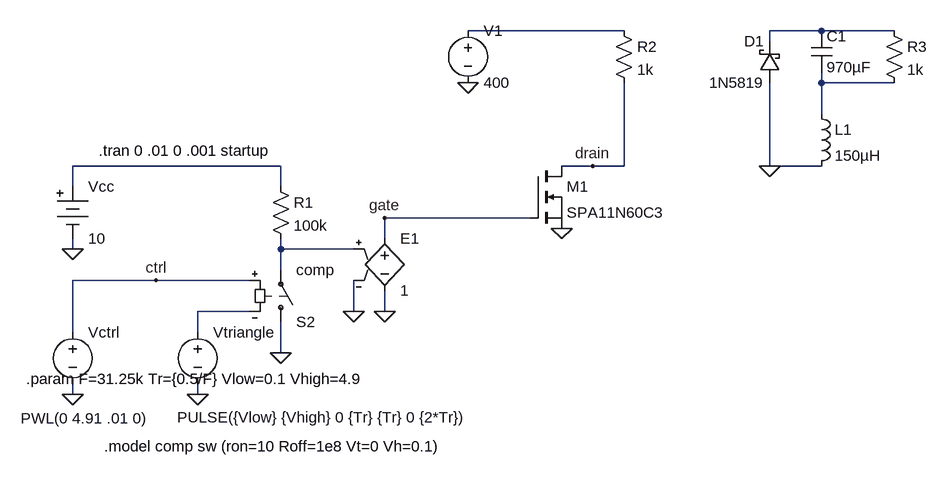
[diagram p0: schematic ripplecompensator4-regularfet.asc]
ripplecompensator4-regularfet.asc, the LTspice schematic file:
Version 4
SHEET 1 1420 680
WIRE 688 -160 448 -160
WIRE 992 -160 912 -160
WIRE 1104 -160 992 -160
WIRE 912 -144 912 -160
WIRE 992 -80 992 -96
WIRE 1104 -80 992 -80
WIRE 992 -32 992 -80
WIRE 160 48 -160 48
WIRE 640 48 592 48
WIRE 688 48 688 -80
WIRE 688 48 640 48
WIRE 912 48 912 -80
WIRE 992 48 912 48
WIRE -160 80 -160 48
WIRE 160 80 160 48
WIRE 544 128 320 128
WIRE 320 160 320 128
WIRE -160 176 -160 160
WIRE 160 176 160 160
WIRE 272 176 160 176
WIRE 160 208 160 176
WIRE -32 224 -160 224
WIRE 112 224 -32 224
WIRE 112 272 32 272
WIRE 272 272 272 224
WIRE 320 272 320 240
WIRE -160 304 -160 224
WIRE 32 304 32 272
WIRE 160 336 160 288
WIRE -160 400 -160 384
WIRE 32 400 32 384
FLAG 160 336 0
FLAG 32 400 0
FLAG -160 400 0
FLAG -160 176 0
FLAG 320 272 0
FLAG 272 272 0
FLAG 320 128 gate
FLAG -32 224 ctrl
FLAG 640 48 drain
FLAG 448 -80 0
FLAG 592 144 0
FLAG 912 48 0
SYMBOL sw 160 304 M180
SYMATTR InstName S2
SYMATTR Value comp
SYMBOL res 144 64 R0
SYMATTR InstName R1
SYMATTR Value 100k
SYMBOL voltage 32 288 R0
WINDOW 3 -31 147 Left 2
WINDOW 123 0 0 Left 2
WINDOW 39 0 0 Left 2
SYMATTR Value PULSE({Vlow} {Vhigh} 0 {Tr} {Tr} 0 {2*Tr})
SYMATTR InstName Vtriangle
SYMBOL voltage -160 288 R0
WINDOW 3 -80 149 Left 2
WINDOW 123 0 0 Left 2
WINDOW 39 0 0 Left 2
SYMATTR Value PWL(0 4.91 .01 0)
SYMATTR InstName Vctrl
SYMBOL battery -160 64 R0
WINDOW 123 0 0 Left 2
WINDOW 39 0 0 Left 2
SYMATTR InstName Vcc
SYMATTR Value 10
SYMBOL e 320 144 R0
SYMATTR InstName E1
SYMATTR Value 1
SYMBOL ind 976 -48 R0
SYMATTR InstName L1
SYMATTR Value 150µH
SYMBOL schottky 928 -80 R180
WINDOW 0 24 64 Left 2
WINDOW 3 24 0 Left 2
SYMATTR InstName D1
SYMATTR Value 1N5819
SYMATTR Description Diode
SYMATTR Type diode
SYMBOL cap 976 -160 R0
SYMATTR InstName C1
SYMATTR Value 970µF
SYMBOL voltage 448 -176 R0
WINDOW 123 0 0 Left 2
WINDOW 39 0 0 Left 2
SYMATTR InstName V1
SYMATTR Value 400
SYMBOL res 1088 -176 R0
SYMATTR InstName R3
SYMATTR Value 1k
SYMBOL nmos 544 48 R0
SYMATTR InstName M1
SYMATTR Value SPA11N60C3
SYMBOL res 672 -176 R0
SYMATTR InstName R2
SYMATTR Value 1k
TEXT -112 480 Left 2 !.model comp sw (ron=10 Roff=1e8 Vt=0 Vh=0.1)
TEXT -232 376 Left 2 !.param F=31.25k Tr={0.5/F} Vlow=0.1 Vhigh=4.9
TEXT -120 24 Left 2 !.tran 0 .01 0 .001 startup

The netlist it stands for:
* ripplecompensator4-regularfet.asc
S2 0 N005 ctrl N006 comp
R1 N004 N005 100k
Vtriangle N006 0 PULSE({Vlow} {Vhigh} 0 {Tr} {Tr} 0 {2*Tr})
Vctrl ctrl 0 PWL(0 4.91 .01 0)
Vcc N004 0 10
E1 gate 0 N005 0 1
L1 N003 0 150µH
D1 0 N002 1N5819
C1 N002 N003 970µF
V1 N001 0 400
R3 N002 N003 1k
M1 drain gate 0 0 SPA11N60C3
R2 N001 drain 1k
.model D D
.lib standard.dio
.model NMOS NMOS
.model PMOS PMOS
.lib standard.mos
.model comp sw (ron=10 Roff=1e8 Vt=0 Vh=0.1)
.param F=31.25k Tr={0.5/F} Vlow=0.1 Vhigh=4.9
.tran 0 .01 0 .001 startup
.backanno
.end